# EAGLE schematic top (EAGLE 9.6.2)
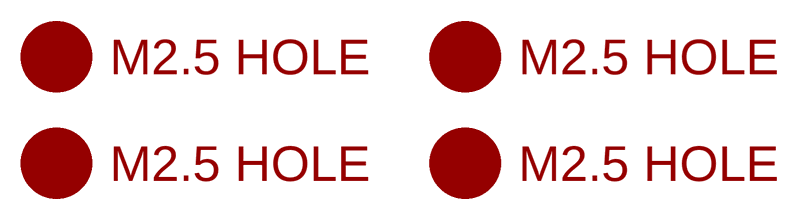
[diagram p0: schematic, sheet 1]

## Parts
U$8  M2.5HOLE  [M2.5HOLE]
U$9  M2.5HOLE  [M2.5HOLE]
U$10  M2.5HOLE  [M2.5HOLE]
U$11  M2.5HOLE  [M2.5HOLE]

## Library data of the parts
U$8-U$11 = f1c100s:M2.5HOLE